# Altium schematic sheet nRF_DK.SchDoc
size A3; DocumentNumber: 2; SheetNumber: 2; SheetTotal: 9
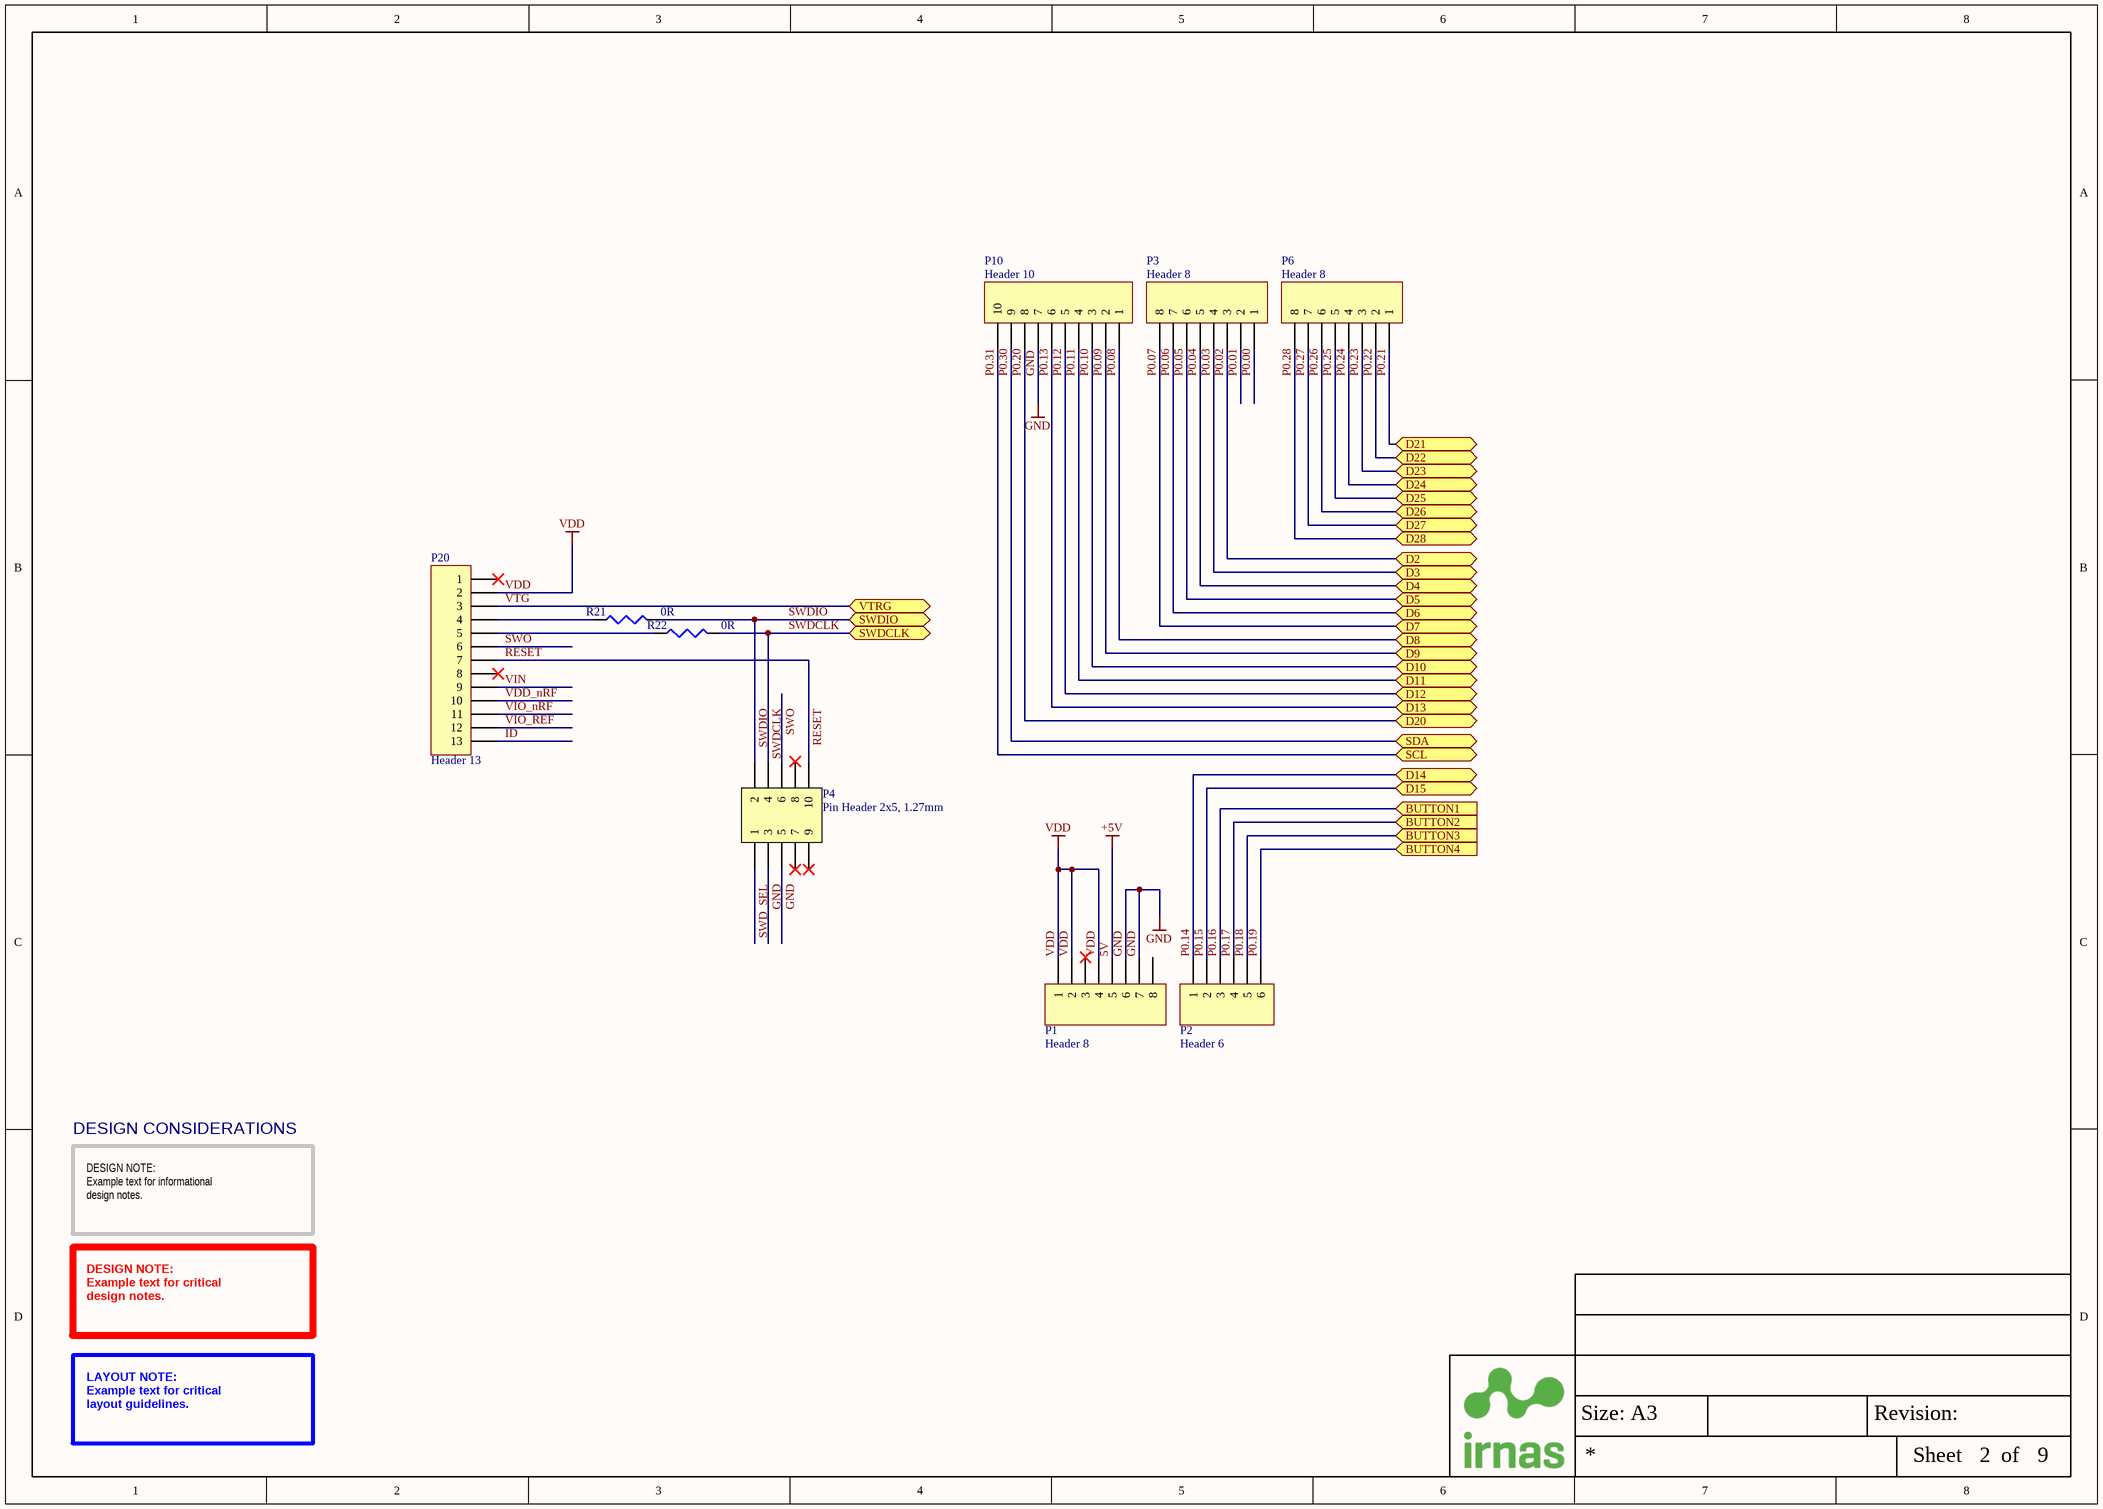
[diagram p0: nRF_DK.SchDoc]

## Parts
P1  Header 8  [HDR1X8]
P2  Header 6  [HDR1X6]
P3  Header 8  [HDR1X8]
P4  Pin Header 2x5, 1.27mm  [HDR_2x5-SMD-1.27mm-K]
P6  Header 8  [HDR1X8]
P10  Header 10  [HDR1X10]
P20  Header 13  [HDR1X13]
R21  0R  [RES0402]
R22  0R  [RES0402]

## Ports
BUTTON1 (in), BUTTON2 (in), BUTTON3 (in), BUTTON4 (in), D2 (bidir), D3 (bidir), D4 (bidir), D5 (bidir), D6 (bidir), D7 (bidir), D8 (bidir), D9 (bidir), D10 (bidir), D11 (bidir), D12 (bidir), D13 (bidir), D14 (bidir), D15 (bidir), D20 (bidir), D21 (bidir), D22 (bidir), D23 (bidir), D24 (bidir), D25 (bidir), D26 (bidir), D27 (bidir), D28 (bidir), SCL (bidir), SDA (bidir), SWDCLK (bidir), SWDIO (bidir), VTRG (bidir)

## Nets
5V: P1.5  [also labelled +5V]
GND: P1.6 P1.7 P4.3 P4.5 P10.7
VDD: P1.1 P1.2 P1.4 P20.2
ID: P20.13
P0.00: P3.1
P0.01: P3.2
P0.02: P3.3 ; port D2
P0.03: P3.4 ; port D3
P0.04: P3.5 ; port D4
P0.05: P3.6 ; port D5
P0.06: P3.7 ; port D6
P0.07: P3.8 ; port D7
P0.08: P10.1 ; port D8
P0.09: P10.2 ; port D9
P0.10: P10.3 ; port D10
P0.11: P10.4 ; port D11
P0.12: P10.5 ; port D12
P0.13: P10.6 ; port D13
P0.14: P2.1 ; port D14
P0.15: P2.2 ; port D15
P0.16: P2.3 ; port BUTTON1
P0.17: P2.4 ; port BUTTON2
P0.18: P2.5 ; port BUTTON3
P0.19: P2.6 ; port BUTTON4
P0.20: P10.8 ; port D20
P0.21: P6.1 ; port D21
P0.22: P6.2 ; port D22
P0.23: P6.3 ; port D23
P0.24: P6.4 ; port D24
P0.25: P6.5 ; port D25
P0.26: P6.6 ; port D26
P0.27: P6.7 ; port D27
P0.28: P6.8 ; port D28
P0.30: P10.9 ; port SDA
P0.31: P10.10 ; port SCL
RESET: P4.10 P20.7
SWD_SEL: P4.1
SWDCLK: P4.4 R22.2 ; port SWDCLK
SWDIO: P4.2 R21.2 ; port SWDIO
SWO: P4.6 P20.6
VDD_nRF: P20.10
VIN: P20.9
VIO_nRF: P20.11
VIO_REF: P20.12
VTG: P20.3 ; port VTRG
NetP20_4: P20.4 R21.1
NetP20_5: P20.5 R22.1

Not connected (* = marked no-connect by the designer): P1 3* 8; P4 7* 8* 9*; P20 1* 8*

## Notes on the sheet
- DESIGN CONSIDERATIONS
- DESIGN NOTE:
  Example text for informational
  design notes.
- DESIGN NOTE:
  Example text for critical
  design notes.
- LAYOUT NOTE:
  Example text for critical
  layout guidelines.
- Size: A3
- Revision:
- Sheet
- of

## Library data of the parts
P1 P3 P6 = Header 8: Header, 8-Pin; LatestRevisionDate: 17-Jul-2002; LatestRevisionNote: Re-released for DXP Platform.; Publisher: Altium Limited
P2 = Header 6: Header, 6-Pin; LatestRevisionDate: 17-Jul-2002; LatestRevisionNote: Re-released for DXP Platform.; Publisher: Altium Limited
P4 = CONN-2x5: Pin Header 2x5, 1.27mm (50mil), SMD, Keying Shroud; Part Number: Pin Header 2x5 SMD, 1.27mm, KS; Manufacturer: W-CON; Manufacturer Part Number: 3132-10MS0BK00R1; Part number IPS: 00000009968; Artikkelnr Noca: 55010009; Footprint Doc: HDR_2x5-SMD-1.27mm; LatestRevisionDate: 2016-04-21; Pin Count: 10; Publisher: Nordic Semiconductor; Published: 2016-01-22; Value: Pin Header 2x5, 1.27mm; Note: *; ComponentLink1URL: *; ComponentLink1Description: Datasheet; ComponentLink2URL: *; ComponentLink2Description: Supplier link; HelpURL: \\hizz\pro\app9717\Datasheet\connectores\W-CON\3132-XXMXXBK00XX.pdf; Supplier 1: Cabcon; Supplier Part Number 1: 3132-10MS0BK00R1; Supplier 2: Samtec; Supplier Part Number 2: FTSH-105-01-F-DV-K
P10 = Header 10: Header, 10-Pin; LatestRevisionDate: 17-Jul-2002; LatestRevisionNote: Re-released for DXP Platform.; Publisher: Altium Limited
P20 = Header 13: Header, 13-Pin; LatestRevisionDate: 17-Jul-2002; LatestRevisionNote: Re-released for DXP Platform.; Publisher: Altium Limited
R21 R22 = R - 0R/0402: RESISTOR, 0402, 0R, ANTI SULFURATION; Manufacturer: Multicomp; Manufacturer Part Number: MCMR04X000PTL; IRNAS Part No.: I-100016; Voltage Rating: 50V; Resistance: 0mR; Power Rating: 62.5mW; Temperature Coefficient: 400ppm/°C; Supplier 1: Farnell; Stock 1: 0; Pricing 1: 10=0.0057, 100=0.0034, 500=0.0024, 2500=0.0019, 5000=0.0015 (EUR); Case/Package: 0402; Case Code (Metric): 1005; Case Code (Imperial): 0402; Packaging: Cut Tape; Composition: Ceramic; Voltage Rating (DC): 50V; REACH SVHC: No SVHC; ComponentLink1URL: https://datasheet.ciiva.com/7776/1716705-7776974.pdf; ComponentLink1Description: https://datasheet.ciiva.com/7776/1716705-7776974.pdf; ComponentLink2URL: https://datasheet.ciiva.com/28677/1716705-28677161.pdf; ComponentLink2Description: https://datasheet.ciiva.com/28677/1716705-28677161.pdf; Supplier Part Number 1: 2072513